# Altium schematic sheet 020_WiFi WL1807MOD.SchDoc
size 420 x 297 mm; Page Create Date: May 29, 2006; WebSite: https://www.seeedstudio.com; Variant Name: <Core Design>; Page Number: 20; Drawing: qxn; Schematic Name: BeaglePlay; Page Size: A3; Comment: Seeed Title; Page Count: 22; Page Name: 020_WiFi WL1807MOD; Company: Seeed Studio; RevCode: v0.2; DsnPath: C:\Users\a0488739\Documents\GitHub\beagleplay\allegro\DVT\BEAGLEPLAYV020_220915.DSN; SchematicName: BeaglePlay; PageName: 020_WiFi WL1807MOD; PageSize: A3; TopSchematic: True
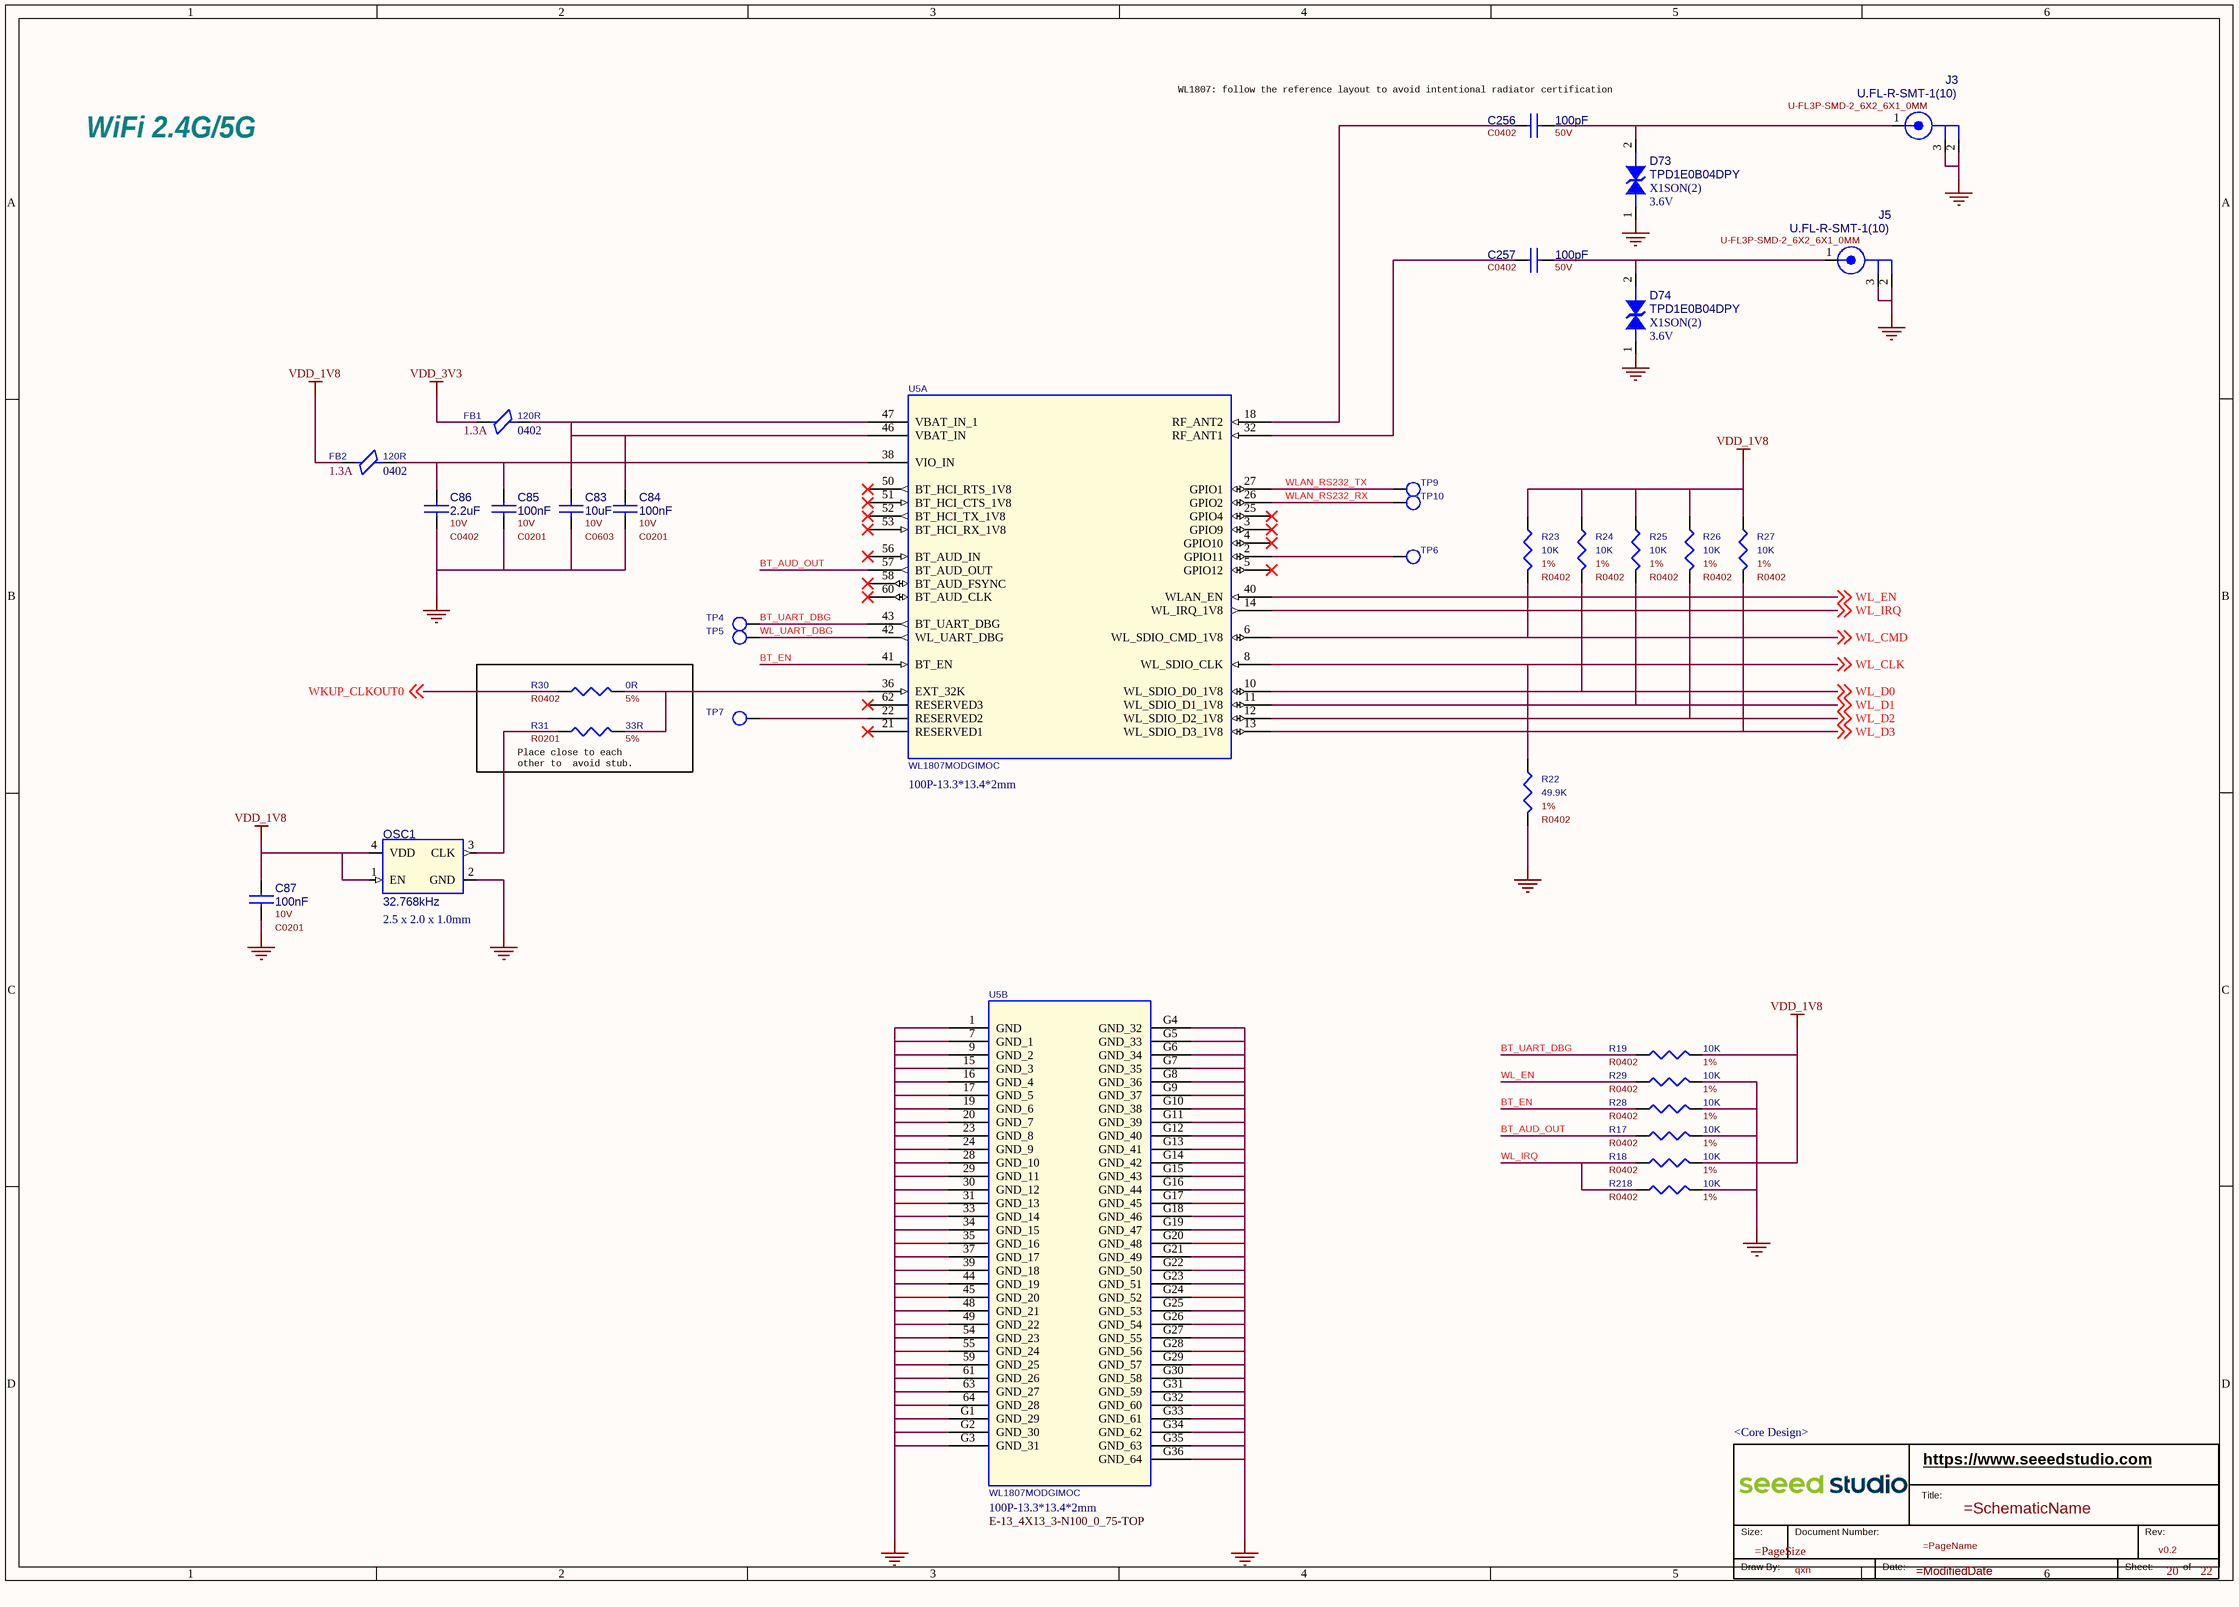
[diagram p0: 020_WiFi WL1807MOD.SchDoc]

## Parts
*  RevCode: v0.2  Page Number: 20  Page Count: 22  Drawing: qxn  Variant Name: <Core Design>  (hidden comment: Seeed Title)  (graphical)
C83  value 10uF  Rating: 10V  [C0603]  (hidden comment: CC)
C84  value 100nF  Rating: 10V  [C0201]  (hidden comment: CC)
C85  value 100nF  Rating: 10V  [C0201]  (hidden comment: CC)
C86  value 2.2uF  Rating: 10V  [C0402]  (hidden comment: CC)
C87  value 100nF  Rating: 10V  [C0201]  (hidden comment: CC)
C256  value 100pF  Rating: 50V  [C0402]  (hidden comment: CC)
C257  value 100pF  Rating: 50V  [C0402]  (hidden comment: CC)
D73  value TPD1E0B04DPY  Package Size: X1SON(2)  Rated Voltage: 3.6V  [x1son2_0d65_1x0_6x0_45mm]  (hidden comment: DIODE TVS BI-DIR)
D74  value TPD1E0B04DPY  Package Size: X1SON(2)  Rated Voltage: 3.6V  [x1son2_0d65_1x0_6x0_45mm]  (hidden comment: DIODE TVS BI-DIR)
FB1  value 120R  Rating: 1.3A  Package Size: 0402  [L0402]  (hidden comment: FB)
FB2  value 120R  Rating: 1.3A  Package Size: 0402  [L0402]  (hidden comment: FB)
J3  value U.FL-R-SMT-1(10)  [U-FL3P-SMD-2_6X2_6X1_0MM]  (hidden comment: RF ANT 3P)
J5  value U.FL-R-SMT-1(10)  [U-FL3P-SMD-2_6X2_6X1_0MM]  (hidden comment: RF ANT 3P)
OSC1  value 32.768kHz  Package Size: 2.5 x 2.0 x 1.0mm  [X4-SMD-2_5X2_0X1_0MM]  (hidden comment: OSC_4P)
R17  value 10K  Rating: 1%  [R0402]  (hidden comment: R)
R18  value 10K  Rating: 1%  [R0402]  (hidden comment: R)
R19  value 10K  Rating: 1%  [R0402]  (hidden comment: R)
R22  value 49.9K  Rating: 1%  [R0402]  (hidden comment: R)
R23  value 10K  Rating: 1%  [R0402]  (hidden comment: R)
R24  value 10K  Rating: 1%  [R0402]  (hidden comment: R)
R25  value 10K  Rating: 1%  [R0402]  (hidden comment: R)
R26  value 10K  Rating: 1%  [R0402]  (hidden comment: R)
R27  value 10K  Rating: 1%  [R0402]  (hidden comment: R)
R28  value 10K  Rating: 1%  [R0402]  (hidden comment: R)
R29  value 10K  Rating: 1%  [R0402]  (hidden comment: R)
R30  value 0R  Rating: 5%  [R0402]  (hidden comment: R)
R31  value 33R  Rating: 5%  [R0201]  (hidden comment: R)
R218  value 10K  Rating: 1%  [R0402]  (hidden comment: R)
TP4  Test Point  [tp1-8040]  (value not drawn)
TP5  Test Point  [tp1-8040]  (value not drawn)
TP6  Test Point  [tp1-8040]  (value not drawn)
TP7  Test Point  [tp1-8040]  (value not drawn)
TP9  Test Point  [tp1-8040]  (value not drawn)
TP10  Test Point  [tp1-8040]  (value not drawn)
U5  value WL1807MODGIMOC  Package Size: 100P-13.3*13.4*2mm  [E-13_4X13_3-N100_0_75-TOP]  (hidden comment: WL1807MOD)  (parts A,B of 2)

## Nets
GND: C83.2 C84.2 C85.2 C86.2 C87.2 D73.1 D74.1 J3.2(SHIELD1) J3.3(SHIELD2) J5.2(SHIELD1) J5.3(SHIELD2) OSC1.2(GND) R17.2 R22.2 R28.2 R29.2 R218.2 U5.1(GND) U5.7(GND_1) U5.9(GND_2) U5.15(GND_3) U5.16(GND_4) U5.17(GND_5) U5.19(GND_6) U5.20(GND_7) U5.23(GND_8) U5.24(GND_9) U5.28(GND_10) U5.29(GND_11) U5.30(GND_12) U5.31(GND_13) U5.33(GND_14) U5.34(GND_15) U5.35(GND_16) U5.37(GND_17) U5.39(GND_18) U5.44(GND_19) U5.45(GND_20) U5.48(GND_21) U5.49(GND_22) U5.54(GND_23) U5.55(GND_24) U5.59(GND_25) U5.61(GND_26) U5.63(GND_27) U5.64(GND_28) U5.G1(GND_29) U5.G2(GND_30) U5.G3(GND_31) U5.G4(GND_32) U5.G5(GND_33) U5.G6(GND_34) U5.G7(GND_35) U5.G8(GND_36) U5.G9(GND_37) U5.G10(GND_38) U5.G11(GND_39) U5.G12(GND_40) U5.G13(GND_41) U5.G14(GND_42) U5.G15(GND_43) U5.G16(GND_44) U5.G17(GND_45) U5.G18(GND_46) U5.G19(GND_47) U5.G20(GND_48) U5.G21(GND_49) U5.G22(GND_50) U5.G23(GND_51) U5.G24(GND_52) U5.G25(GND_53) U5.G26(GND_54) U5.G27(GND_55) U5.G28(GND_56) U5.G29(GND_57) U5.G30(GND_58) U5.G31(GND_59) U5.G32(GND_60) U5.G33(GND_61) U5.G34(GND_62) U5.G35(GND_63) U5.G36(GND_64)
VDD_1V8: C87.1 FB2.1 OSC1.1(EN) OSC1.4(VDD) R18.2 R19.2 R23.1 R24.1 R25.1 R26.1 R27.1
VDD_3V3: FB1.1
BT_AUD_OUT: R17.1 U5.57(BT_AUD_OUT)
BT_EN: R28.1 U5.41(BT_EN)
BT_UART_DBG: R19.1 TP4.1(TP) U5.43(BT_UART_DBG)
WKUP_CLKOUT0: R30.1 ; off-sheet WKUP_CLKOUT0
WL_CLK: R22.1 U5.8(WL_SDIO_CLK) ; off-sheet WL_CLK
WL_CMD: R23.2 U5.6(WL_SDIO_CMD_1V8) ; off-sheet WL_CMD
WL_D0: R24.2 U5.10(WL_SDIO_D0_1V8) ; off-sheet WL_D0
WL_D1: R25.2 U5.11(WL_SDIO_D1_1V8) ; off-sheet WL_D1
WL_D2: R26.2 U5.12(WL_SDIO_D2_1V8) ; off-sheet WL_D2
WL_D3: R27.2 U5.13(WL_SDIO_D3_1V8) ; off-sheet WL_D3
WL_EN: R29.1 U5.40(WLAN_EN) ; off-sheet WL_EN
WL_IRQ: R18.1 R218.1 U5.14(WL_IRQ_1V8) ; off-sheet WL_IRQ
WL_UART_DBG: TP5.1(TP) U5.42(WL_UART_DBG)
WLAN_RS232_RX: TP10.1(TP) U5.26(GPIO2)
WLAN_RS232_TX: TP9.1(TP) U5.27(GPIO1)
NetC83_1: C83.1 C84.1 FB1.2 U5.46(VBAT_IN) U5.47(VBAT_IN_1)
NetC85_1: C85.1 C86.1 FB2.2 U5.38(VIO_IN)
NetC256_1: C256.1 U5.18(RF_ANT2)
NetC256_2: C256.2 D73.2 J3.1(CENTER)
NetC257_1: C257.1 U5.32(RF_ANT1)
NetC257_2: C257.2 D74.2 J5.1(CENTER)
NetOSC1_3: OSC1.3(CLK) R31.1
NetR30_2: R30.2 R31.2 U5.36(EXT_32K)
NetTP6_1: TP6.1(TP) U5.2(GPIO11)
NetTP7_1: TP7.1(TP) U5.22(RESERVED2)

Not connected (* = marked no-connect by the designer): U5 3(GPIO9)* 4(GPIO10)* 5(GPIO12)* 21(RESERVED1)* 25(GPIO4)* 50(BT_HCI_RTS_1V8)* 51(BT_HCI_CTS_1V8)* 52(BT_HCI_TX_1V8)* 53(BT_HCI_RX_1V8)* 56(BT_AUD_IN)* 58(BT_AUD_FSYNC)* 60(BT_AUD_CLK)* 62(RESERVED3)*

## Notes on the sheet
- (near C256) WL1807: follow the reference layout to avoid intentional radiator certification
- WiFi 2.4G/5G
- (near R31) Place close to each
  other to  avoid stub.
- (in symbol Seeed Title) https://www.seeedstudio.com; Title:; Size:; Document Number:; Rev:; Draw By:; Date:; Sheet:; of

## Library data of the parts
* = Seeed Title: Company: Seeed Studio; WebSite: https://www.seeedstudio.com; Schematic Name: =SchematicName; Page Size: =PageSize; Page Name: =PageName; Page Create Date: May 29, 2006; Page Modify Date: =ModifiedDate
C83 = CC: CAP, Ceramic, SMD, 10uF, 10%, 10V, 0603; Part Reference: C83; Manufacturer PN: CC0603KRX5R6BB106; Manufacturer: YAGEO; Company Part Status: BeagleBone Carrier Board; CLASS: DISCRETE; Temperature Coefficient: X5R; PN: 302010103; PCB Footprint: C0603; Tolerance: 10%; Dielectric Type: Ceramic; Package Size: 0603
C84 = CC: CAP, Ceramic, SMD, 100nF, 10%, 10V, 0201; Part Reference: C84; Manufacturer PN: CC0201KRX5R6BB104; Manufacturer: YAGEO; Company Part Status: ODYSSEY-i.MX8M; CLASS: DISCRETE; Temperature Coefficient: X5R; PN: 302010271; PCB Footprint: C0201; Tolerance: 10%; Dielectric Type: Ceramic; Package Size: 0201
C85 = CC: CAP, Ceramic, SMD, 100nF, 10%, 10V, 0201; Part Reference: C85; Manufacturer PN: CC0201KRX5R6BB104; Manufacturer: YAGEO; Company Part Status: ODYSSEY-i.MX8M; CLASS: DISCRETE; Temperature Coefficient: X5R; PN: 302010271; PCB Footprint: C0201; Tolerance: 10%; Dielectric Type: Ceramic; Package Size: 0201
C86 = CC: CAP, Ceramic, SMD, 2.2uF, 10%, 10V, 0402; Part Reference: C86; Manufacturer PN: CC0402KRX5R6BB225; Manufacturer: YAGEO; Company Part Status: BeagleConnect_Robotics_Joystick; CLASS: DISCRETE; Temperature Coefficient: X5R; PN: 302012819; PCB Footprint: C0402; Tolerance: 10%; Dielectric Type: Ceramic; Package Size: 0402
C87 = CC: CAP, Ceramic, SMD, 100nF, 10%, 10V, 0201; Part Reference: C87; Company Part Status: ODYSSEY-i.MX8M; Manufacturer: YAGEO; Manufacturer PN: CC0201KRX5R6BB104; SIGNAL_MODEL: DEFAULT_CAPACITOR_100000pF_1_2; PN: 302010271; Temperature Coefficient: X5R; CLASS: DISCRETE; PCB Footprint: C0201; Package Size: 0201; Dielectric Type: Ceramic; Tolerance: 10%
C256 = CC: CAP, Ceramic, SMD, 100pF, 5%, 50V, 0402; Part Reference: C256; Manufacturer PN: CC0402JRNPO9BN101; Company Part Status: Testo PoE; Manufacturer: YAGEO; CLASS: DISCRETE; PN: 302010012; PCB Footprint: C0402; Tolerance: 5%; Dielectric Type: Ceramic; Package Size: 0402; Manufacturer Part Number: CC0402JRNPO9BN101; Part Type: Ceramic; Status: Testo PoE; Temperature: -55¡ãC to 125¡ãC
C257 = CC: CAP, Ceramic, SMD, 100pF, 5%, 50V, 0402; Part Reference: C257; Manufacturer PN: CC0402JRNPO9BN101; Company Part Status: Testo PoE; Manufacturer: YAGEO; CLASS: DISCRETE; PN: 302010012; PCB Footprint: C0402; Tolerance: 5%; Dielectric Type: Ceramic; Package Size: 0402; Manufacturer Part Number: CC0402JRNPO9BN101; Part Type: Ceramic; Status: Testo PoE; Temperature: -55¡ãC to 125¡ãC
D73 = DIODE TVS BI-DIR: DIO, ESD, TPD1E0B04DPY, --, 3.6V, --, X1SON(2); Part Reference: D73; Company Part Status: BeaglePlay; Manufacturer: TI; Manufacturer PN: TPD1E0B04DPYR; PN: 304051038; CLASS: DISCRETE; PCB Footprint: x1son2_0d65_1x0_6x0_45mm
D74 = DIODE TVS BI-DIR: DIO, ESD, TPD1E0B04DPY, --, 3.6V, --, X1SON(2); Part Reference: D74; Company Part Status: BeaglePlay; Manufacturer: TI; Manufacturer PN: TPD1E0B04DPYR; PN: 304051038; CLASS: DISCRETE; PCB Footprint: x1son2_0d65_1x0_6x0_45mm
FB1 = FB: Ferrite Bead, 120R, , 1.3A, 0402; Part Reference: FB1; Manufacturer PN: BLM15PD121SN1D; Manufacturer: Murata; Company Part Status: BeagleBone Carrier Board; CLASS: DISCRETE; PN: 303030040; PCB Footprint: L0402
FB2 = FB: Ferrite Bead, 120R, , 1.3A, 0402; Part Reference: FB2; Manufacturer PN: BLM15PD121SN1D; Manufacturer: Murata; Company Part Status: BeagleBone Carrier Board; CLASS: DISCRETE; PN: 303030040; PCB Footprint: L0402
J3 = RF ANT 3P: CONN, RF Connector, 3P, SMD; Part Reference: J3; Manufacturer: HRS; Company Part Status: Seeed BeagleBone Green Gateway; CLASS: IO; PN: 320111077; PCB Footprint: U-FL3P-SMD-2_6X2_6X1_0MM; Manufacturer PN: U.FL-R-SMT-1(10); Package Size: 3P-L2.6*W2.6*H1.25mm
J5 = RF ANT 3P: CONN, RF Connector, 3P, SMD; Part Reference: J5; Company Part Status: Seeed BeagleBone Green Gateway; Manufacturer: HRS; PN: 320111077; CLASS: IO; PCB Footprint: U-FL3P-SMD-2_6X2_6X1_0MM; Package Size: 3P-L2.6*W2.6*H1.25mm; Manufacturer PN: U.FL-R-SMT-1(10)
OSC1 = OSC_4P: Oscillator, SMD, 32.768kHz, 30 ppm, --; Part Reference: OSC1; Manufacturer PN: 1651-L3273-BTKQYA; Manufacturer: Interquip; Company Part Status: BeaglePlay; CLASS: DISCRETE; Frequency Tolerance: 30 ppm; PN: 306020821; PCB Footprint: X4-SMD-2_5X2_0X1_0MM
R17 = R: RES, Thick Film, 10K, 1%, 1/16W, SMD, 0402; Part Reference: R17; Company Part Status: BeagleBone Carrier Board; Manufacturer: YAGEO; Manufacturer PN: RC0402FR-0710KL; PN: 301010047; CLASS: DISCRETE; PCB Footprint: R0402; Package Size: 0402; Rated Power: 1/16W
R18 = R: RES, Thick Film, 10K, 1%, 1/16W, SMD, 0402; Part Reference: R18; Company Part Status: BeagleBone Carrier Board; Manufacturer: YAGEO; Manufacturer PN: RC0402FR-0710KL; PN: 301010047; CLASS: DISCRETE; PCB Footprint: R0402; Package Size: 0402; Rated Power: 1/16W
R19 = R: RES, Thick Film, 10K, 1%, 1/16W, SMD, 0402; Part Reference: R19; Company Part Status: BeagleBone Carrier Board; Manufacturer: YAGEO; Manufacturer PN: RC0402FR-0710KL; PN: 301010047; CLASS: DISCRETE; PCB Footprint: R0402; Package Size: 0402; Rated Power: 1/16W
R22 = R: RES, Thick Film, 49.9K, 1%, 1/16W, SMD, 0402; Part Reference: R22; Manufacturer: YAGEO; Manufacturer PN: RC0402FR-0749K9L; SIGNAL_MODEL: DEFAULT_RESISTOR_49900OHM_1_2; PN: 301010457; CLASS: DISCRETE; PCB Footprint: R0402; Package Size: 0402; Rated Power: 1/16W
R23 = R: RES, Thick Film, 10K, 1%, 1/16W, SMD, 0402; Part Reference: R23; Manufacturer PN: RC0402FR-0710KL; Manufacturer: YAGEO; Company Part Status: BeagleBone Carrier Board; CLASS: DISCRETE; PN: 301010047; PCB Footprint: R0402; Package Size: 0402; Rated Power: 1/16W
R24 = R: RES, Thick Film, 10K, 1%, 1/16W, SMD, 0402; Part Reference: R24; Manufacturer PN: RC0402FR-0710KL; Manufacturer: YAGEO; Company Part Status: BeagleBone Carrier Board; CLASS: DISCRETE; PN: 301010047; PCB Footprint: R0402; Package Size: 0402; Rated Power: 1/16W
R25 = R: RES, Thick Film, 10K, 1%, 1/16W, SMD, 0402; Part Reference: R25; Manufacturer PN: RC0402FR-0710KL; Manufacturer: YAGEO; Company Part Status: BeagleBone Carrier Board; CLASS: DISCRETE; PN: 301010047; PCB Footprint: R0402; Package Size: 0402; Rated Power: 1/16W
R26 = R: RES, Thick Film, 10K, 1%, 1/16W, SMD, 0402; Part Reference: R26; Manufacturer PN: RC0402FR-0710KL; Manufacturer: YAGEO; Company Part Status: BeagleBone Carrier Board; CLASS: DISCRETE; PN: 301010047; PCB Footprint: R0402; Package Size: 0402; Rated Power: 1/16W
R27 = R: RES, Thick Film, 10K, 1%, 1/16W, SMD, 0402; Part Reference: R27; Manufacturer PN: RC0402FR-0710KL; Manufacturer: YAGEO; Company Part Status: BeagleBone Carrier Board; CLASS: DISCRETE; PN: 301010047; PCB Footprint: R0402; Package Size: 0402; Rated Power: 1/16W
R28 = R: RES, Thick Film, 10K, 1%, 1/16W, SMD, 0402; Part Reference: R28; Company Part Status: BeagleBone Carrier Board; Manufacturer: YAGEO; Manufacturer PN: RC0402FR-0710KL; PN: 301010047; CLASS: DISCRETE; PCB Footprint: R0402; Package Size: 0402; Rated Power: 1/16W
R29 = R: RES, Thick Film, 10K, 1%, 1/16W, SMD, 0402; Part Reference: R29; Manufacturer PN: RC0402FR-0710KL; Manufacturer: YAGEO; Company Part Status: BeagleBone Carrier Board; CLASS: DISCRETE; PN: 301010047; PCB Footprint: R0402; Package Size: 0402; Rated Power: 1/16W
R30 = R: RES, Thick Film, 0R, 5%, 1/16W, SMD, 0402; Part Reference: R30; Manufacturer PN: RC0402JR-070RL; Manufacturer: YAGEO; Company Part Status: BeagleBone Carrier Board; CLASS: DISCRETE; PN: 301010000; PCB Footprint: R0402; Rated Power: 1/16W; Package Size: 0402
R31 = R: RES, Thick Film, 33R, 5%, 1/20W, SMD, 0201; Part Reference: R31; Company Part Status: BeagleBone Carrier Board; Manufacturer: YAGEO; Manufacturer PN: RC0201JR-0733RL; PN: 301010675; CLASS: DISCRETE; PCB Footprint: R0201; Package Size: 0201; Rated Power: 1/20W
R218 = R: RES, Thick Film, 10K, 1%, 1/16W, SMD, 0402; Part Reference: R218; Company Part Status: BeagleBone Carrier Board; Manufacturer: YAGEO; Manufacturer PN: RC0402FR-0710KL; PN: 301010047; CLASS: DISCRETE; PCB Footprint: R0402; Package Size: 0402; Rated Power: 1/16W
TP4 = Test Point: MISC, Test Point, Test Point, SMD, TP35S_SMD; Part Reference: TP4; Company Part Status: Mini-Gateway; ASSY: DNP; CLASS: DISCRETE; PCB Footprint: TP35S_SMD; Value: Test Point; PN: TP35S_SMD; Package Size: TP35S_SMD
TP5 = Test Point: MISC, Test Point, Test Point, SMD, TP35S_SMD; Part Reference: TP5; Company Part Status: Mini-Gateway; ASSY: DNP; CLASS: DISCRETE; PCB Footprint: TP35S_SMD; Value: Test Point; PN: TP35S_SMD; Package Size: TP35S_SMD
TP6 = Test Point: MISC, Test Point, Test Point, SMD, TP35S_SMD; Part Reference: TP6; Company Part Status: Mini-Gateway; ASSY: DNP; CLASS: DISCRETE; PCB Footprint: TP35S_SMD; Value: Test Point; Package Size: TP35S_SMD; PN: TP35S_SMD
TP7 = Test Point: MISC, Test Point, Test Point, SMD, TP35S_SMD; Part Reference: TP7; Company Part Status: Mini-Gateway; ASSY: DNP; CLASS: DISCRETE; PCB Footprint: TP35S_SMD; Value: Test Point; PN: TP35S_SMD; Package Size: TP35S_SMD
TP9 = Test Point: MISC, Test Point, Test Point, SMD, TP35S_SMD; Part Reference: TP9; Company Part Status: Mini-Gateway; ASSY: DNP; CLASS: DISCRETE; PCB Footprint: TP35S_SMD; Value: Test Point; Package Size: TP35S_SMD; PN: TP35S_SMD
TP10 = Test Point: MISC, Test Point, Test Point, SMD, TP35S_SMD; Part Reference: TP10; Company Part Status: Mini-Gateway; ASSY: DNP; CLASS: DISCRETE; PCB Footprint: TP35S_SMD; Value: Test Point; Package Size: TP35S_SMD; PN: TP35S_SMD
U5 = WL1807MOD: IC, Modules, WiFi, WL1807MODGIMOC, 100P-13.3*13.4*2mm; Part Reference: U5; Manufacturer PN: WL1807MODGIMOCR; Manufacturer: TI; Company Part Status: BeaglePlay; FPLIST: E-13_4X13_3-N100_0_75-TOP,qfm100_0d7_13_3x13_4x2mm; PN: 317990527; PCB Footprint: E-13_4X13_3-N100_0_75-TOP; CLASS: IC